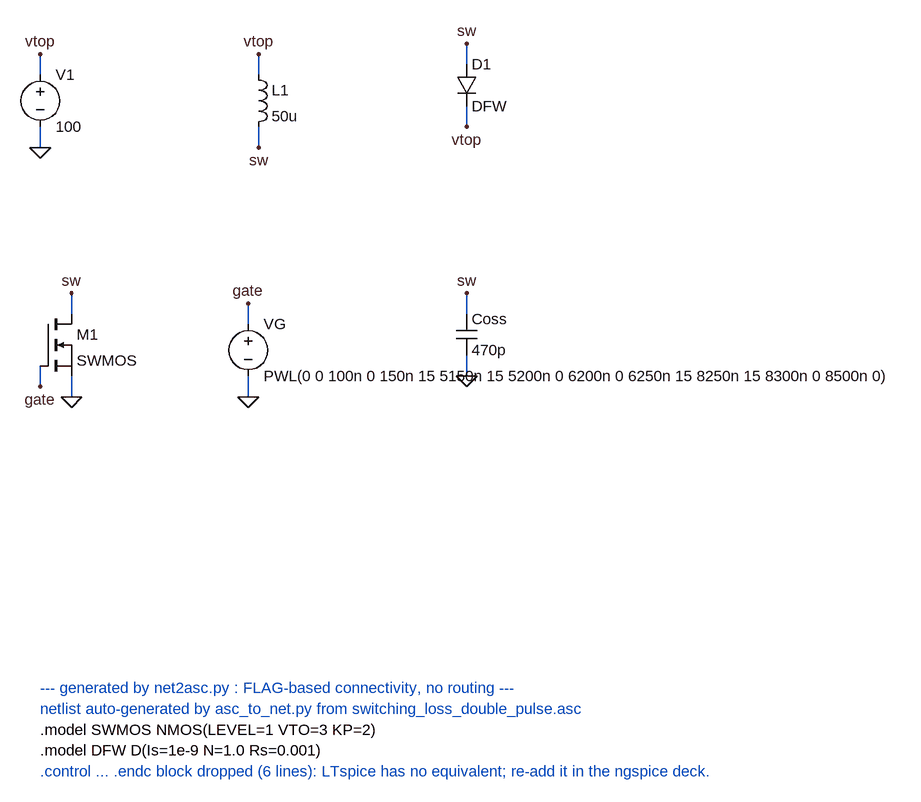
[diagram p0: schematic switching_loss_double_pulse.asc]
switching_loss_double_pulse.asc, the LTspice schematic file:
Version 4
SHEET 1 1056 1288
WIRE 0 16 0 -16
WIRE 0 96 0 128
WIRE 336 16 336 -16
WIRE 336 96 336 128
WIRE 656 0 656 -32
WIRE 656 64 656 96
WIRE 48 384 48 352
WIRE 0 464 0 496
WIRE 48 480 48 512
WIRE 320 400 320 368
WIRE 320 480 320 512
WIRE 656 384 656 352
WIRE 656 448 656 480
FLAG 0 -16 vtop
FLAG 0 128 0
FLAG 336 -16 vtop
FLAG 336 128 sw
FLAG 656 -32 sw
FLAG 656 96 vtop
FLAG 48 352 sw
FLAG 0 496 gate
FLAG 48 512 0
FLAG 320 368 gate
FLAG 320 512 0
FLAG 656 352 sw
FLAG 656 480 0
SYMBOL voltage 0 0 R0
SYMATTR InstName V1
SYMATTR Value 100
SYMBOL ind 320 0 R0
SYMATTR InstName L1
SYMATTR Value 50u
SYMBOL diode 640 0 R0
SYMATTR InstName D1
SYMATTR Value DFW
SYMBOL nmos 0 384 R0
SYMATTR InstName M1
SYMATTR Value SWMOS
SYMBOL voltage 320 384 R0
SYMATTR InstName VG
SYMATTR Value PWL(0 0 100n 0 150n 15 5150n 15 5200n 0 6200n 0 6250n 15 8250n 15 8300n 0 8500n 0)
SYMBOL cap 640 384 R0
SYMATTR InstName Coss
SYMATTR Value 470p
TEXT 0 960 Left 2 ;--- generated by net2asc.py : FLAG-based connectivity, no routing ---
TEXT 0 992 Left 2 ;netlist auto-generated by asc_to_net.py from switching_loss_double_pulse.asc
TEXT 0 1024 Left 2 !.model SWMOS NMOS(LEVEL=1 VTO=3 KP=2)
TEXT 0 1056 Left 2 !.model DFW D(Is=1e-9 N=1.0 Rs=0.001)
TEXT 0 1088 Left 2 ;.control ... .endc block dropped (6 lines): LTspice has no equivalent; re-add it in the ngspice deck.

The netlist it stands for:
* switching_loss_double_pulse.asc
V1 vtop 0 100
L1 vtop sw 50u
D1 sw vtop DFW
M1 sw gate 0 0 SWMOS
VG gate 0 PWL(0 0 100n 0 150n 15 5150n 15 5200n 0 6200n 0 6250n 15 8250n 15 8300n 0 8500n 0)
Coss sw 0 470p
.model D D
.lib standard.dio
.model NMOS NMOS
.model PMOS PMOS
.lib standard.mos
* --- generated by net2asc.py : FLAG-based connectivity, no routing ---
* netlist auto-generated by asc_to_net.py from switching_loss_double_pulse.asc
.model SWMOS NMOS(LEVEL=1 VTO=3 KP=2)
.model DFW D(Is=1e-9 N=1.0 Rs=0.001)
* .control ... .endc block dropped (6 lines): LTspice has no equivalent; re-add it in the ngspice deck.
.backanno
.end